# EAGLE design Chargerv1 (EAGLE 7.2.0)
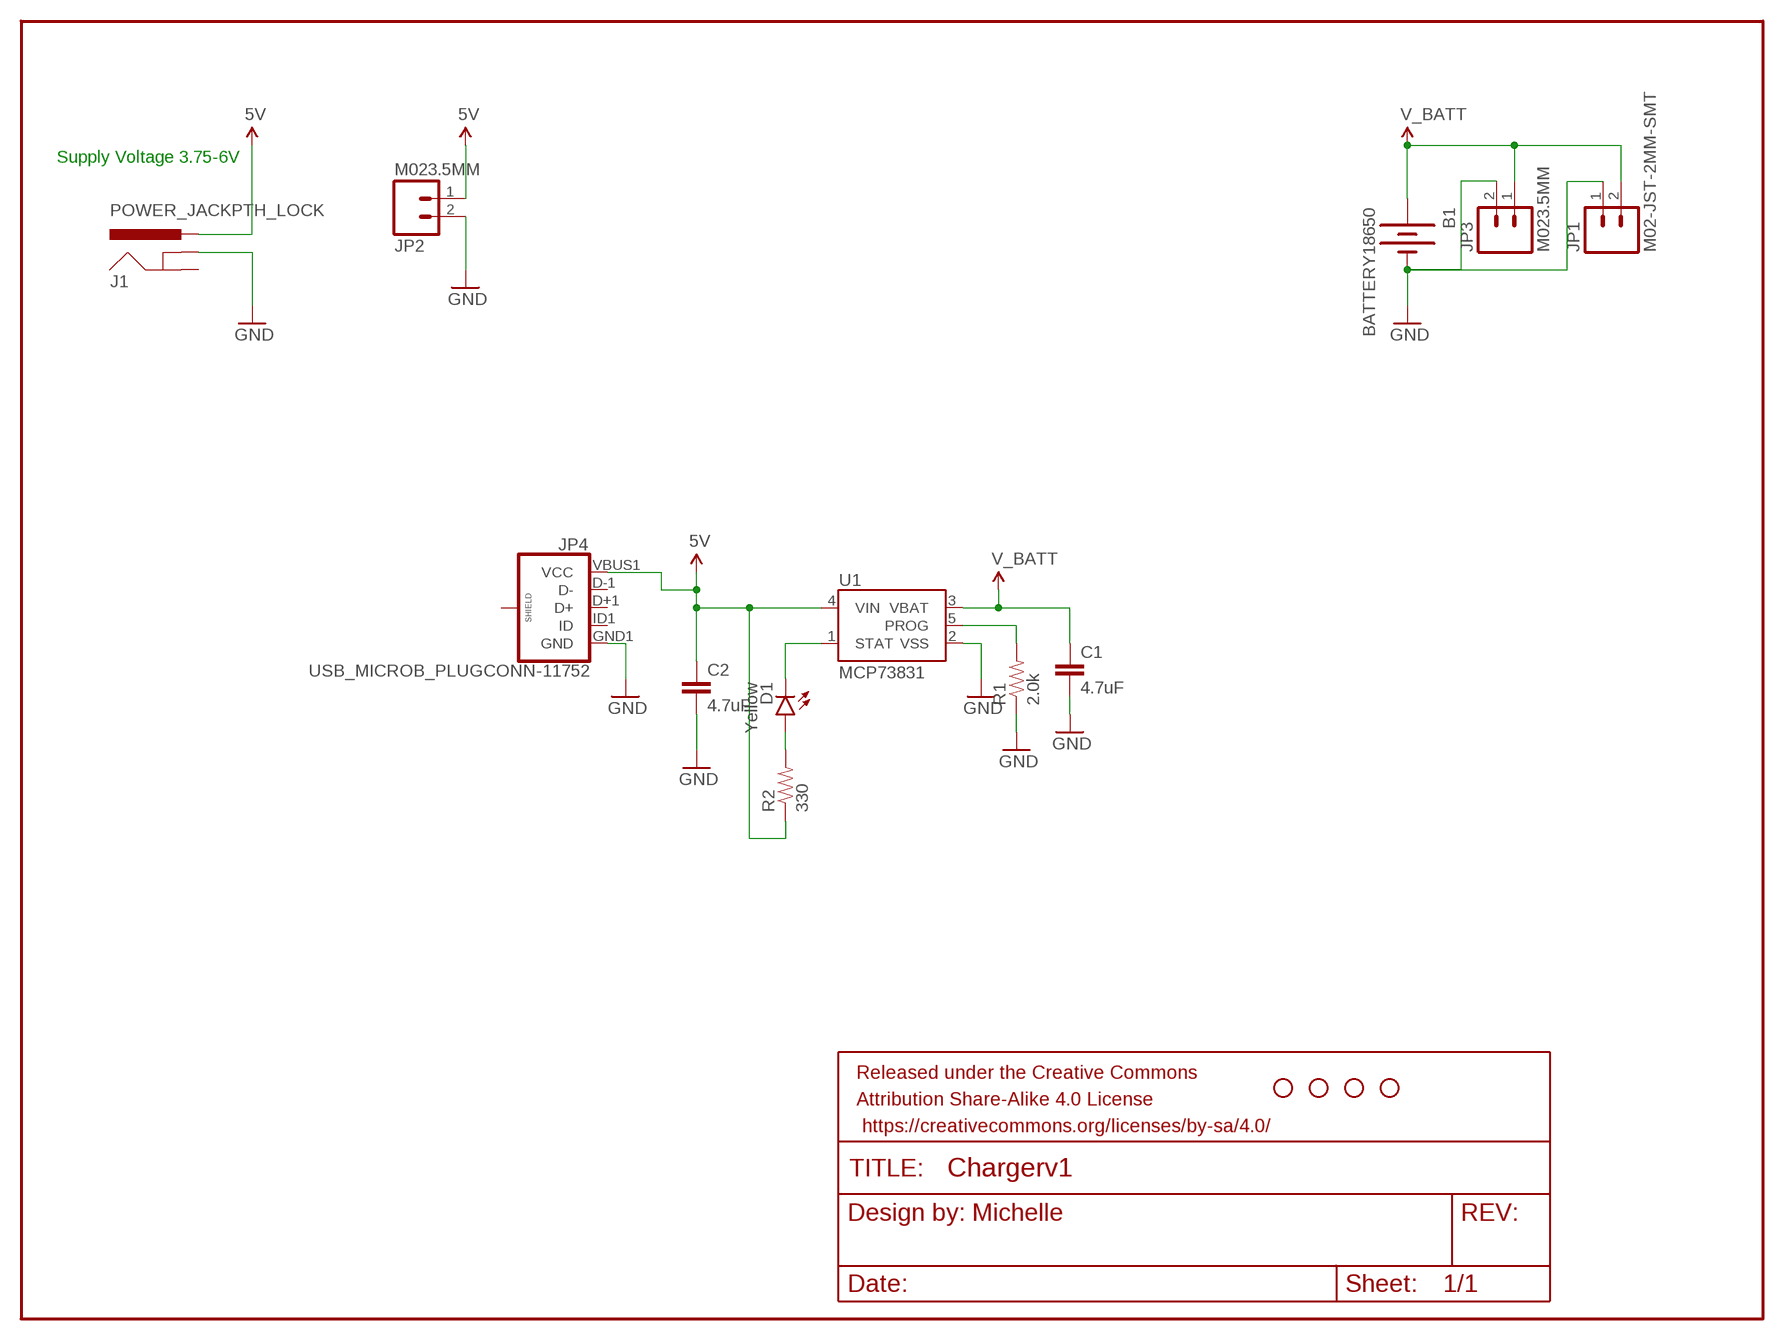
[diagram p0: schematic, sheet 1]

## Parts
B1  BATTERY18650  [18650-HOLDER]
C1  4.7uF  4.7UF-6.3V-10%(0603)0603  [0603-CAP]
C2  4.7uF  4.7UF-6.3V-10%(0603)0603  [0603-CAP]
D1  Yellow  LED-YELLOW0603  [LED-0603]
FRAME1  FRAME-LETTER  [CREATIVE_COMMONS]
J1  POWER_JACKPTH_LOCK  [POWER_JACK_PTH_LOCK]
JP1  M02-JST-2MM-SMT  [JST-2-SMD]
JP2  M023.5MM  [SCREWTERMINAL-3.5MM-2]
JP3  M023.5MM  [SCREWTERMINAL-3.5MM-2]
JP4  USB_MICROB_PLUGCONN-11752  [USB-B-MICRO-SMD_V03]
R1  2.0k  2.0KOHM1/10W5%(0603)  [0603-RES]
R2  330  330OHM1/10W1%(0603)  [0603-RES]
STANDOFF1  STAND-OFF  [STAND-OFF]
STANDOFF2  STAND-OFF  [STAND-OFF]
STANDOFF3  STAND-OFF  [STAND-OFF]
STANDOFF4  STAND-OFF  [STAND-OFF]
U1  MCP73831  [SOT23-5]

## Nets
5V: C2.1 J1.PWR JP2.1 JP4.VBUS1(VCC) R2.1 U1.4(VIN)
GND: B1.GND@1(-) C1.2 C2.2 J1.GNDBREAK JP1.1 JP2.2 JP3.2 JP4.GND1(GND) R1.1 U1.2(VSS)
N$1: D1.A R2.2
N$2: D1.C U1.1(STAT)
N$7: R1.2 U1.5(PROG)
V_BATT: B1.PWR@1(+) C1.1 JP1.2 JP3.1 U1.3(VBAT)
Unconnected: J1.GND JP4.D+1(D+) JP4.D-1(D-) JP4.ID1(ID) JP4.SHIELD1(SHIELD) JP4.SHIELD2(SHIELD) JP4.SHIELD3(SHIELD)

## Notes on the sheet
- Supply Voltage 3.75-6V

## Library data of the parts
B1 = Battery Holder 18650:BATTERY
C1 C2 = SparkFun-Capacitors:4.7UF-6.3V-10%(0603): CAP-08280; PROD_ID: CAP-08280
D1 = SparkFun-LED:LED-YELLOW: Yellow SMD LEDs LilyPad 1206- DIO-09909 0603- DIO-09003; PROD_ID: DIO-09003
FRAME1 = SparkFun-Aesthetics:FRAME-LETTER: Schematic Frame Standard 8.5x11 US Letter frame; DESIGNER: Michelle; VERSION: v01
J1 = SparkFun-Connectors:POWER_JACK: Power Jack This is the standard 5.5mm barrel jack for power. The PTH is the most common, proven, reliable, footprint. The Slot footprint only works if the mill layer is transmitted to the PCB fab house so be warned. Mating wall wart : TOL-00298 (and others); PROD_ID: CONN-08197; SF_ID: PRT-00119
JP1 = SparkFun-Connectors:M02: Standard 2-pin 0.1" header. Use with - straight break away headers ( PRT-00116) - right angle break away headers (PRT-00553) - swiss pins (PRT-00743) - machine pins (PRT-00117) - female headers (PRT-00115) Molex polarized connector foot print use with: PRT-08233 with associated crimp pins and housings. 2.54_SCREWTERM for use with PRT-10571. 3.5mm Screw Terminal footprints for PRT-08084 5mm Screw Terminal footprints for use with PRT-08432; PROD_ID: CONN-08352
JP2 JP3 = SparkFun-Connectors:M02: Standard 2-pin 0.1" header. Use with - straight break away headers ( PRT-00116) - right angle break away headers (PRT-00553) - swiss pins (PRT-00743) - machine pins (PRT-00117) - female headers (PRT-00115) Molex polarized connector foot print use with: PRT-08233 with associated crimp pins and housings. 2.54_SCREWTERM for use with PRT-10571. 3.5mm Screw Terminal footprints for PRT-08084 5mm Screw Terminal footprints for use with PRT-08432
JP4 = SparkFun-Connectors:USB_MICROB_PLUG: USB Micro-B connectors Some male, some female. Watch your step!; PROD_ID: CONN-11752
R1 = SparkFun-Resistors:2.0KOHM1/10W5%(0603): RES-08296; PROD_ID: RES-08296
R2 = SparkFun-Resistors:330OHM1/10W1%(0603): RES-00818; PROD_ID: RES-00818
STANDOFF1-STANDOFF4 = SparkFun-Electromechanical:STAND-OFF: #4 Stand Off This is the mechanical footprint for a #4 phillips button head screw. Use the keepout ring to avoid running the screw head into surrounding components. SKU : PRT-00447
U1 = SparkFun-PowerIC:MCP73831: Miniature single cell, fully integrated Li-Ion, Li-polymer charge management controller http://ww1.microchip.com/downloads/en/DeviceDoc/21984a.pdf IC-09995; PROD_ID: IC-09995

## Board
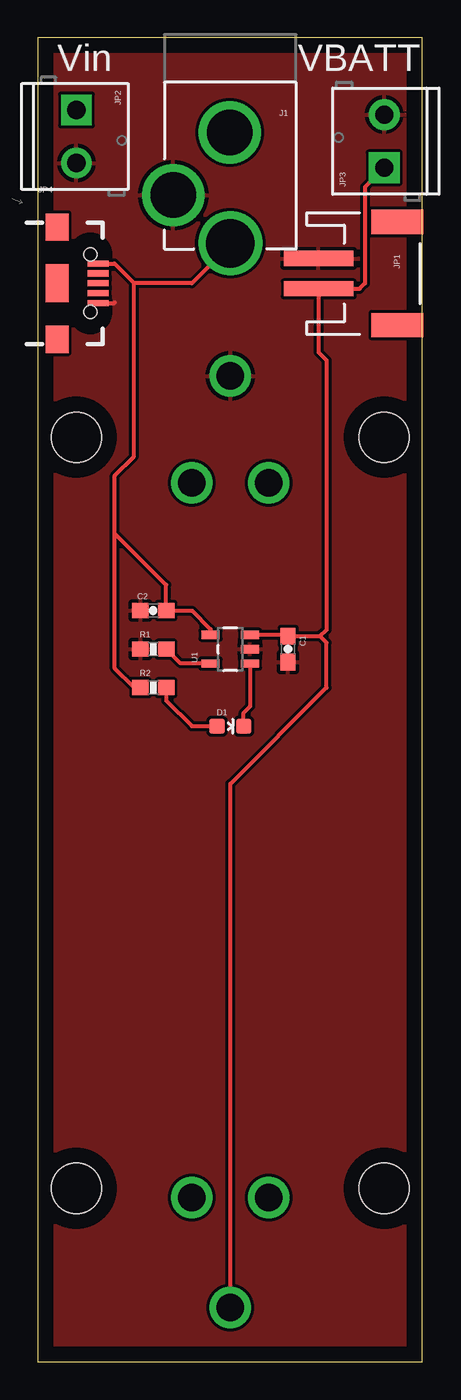
[diagram p1: board, top side]
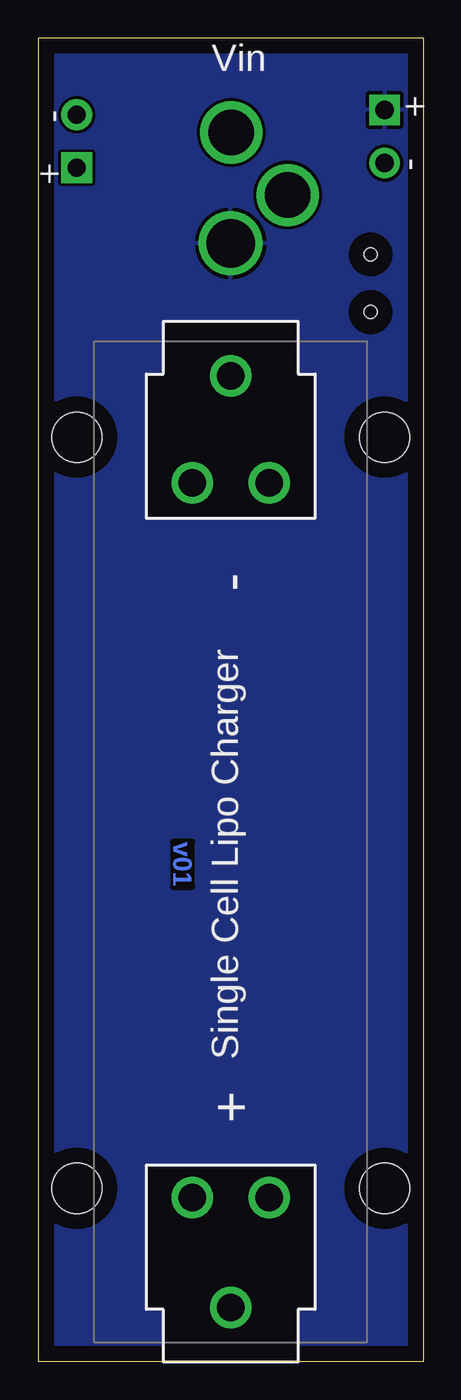
[diagram p2: board, bottom side, seen from below]

Size 25.38 x 87.3 mm. Coordinates in mm from the lower left corner, seen from the top.
Outline: 0,0 25.38,0 25.38,87.3 0,87.3 0,0
Copper layers (1*16): Top 0.035mm / dielectric 1.5mm / Bottom 0.035mm
Design rules "default": minimum track width 10mil, minimum drill 0.6mm, track to track 8mil, track to pad 8mil, pad to pad 8mil, via to via 8mil, smd to smd 8mil, copper to edge 40mil, drill to drill 8mil, minimum pad ring 10mil, minimum via ring 8mil, stop-mask expansion 4mil, vias tented up to drill 0mil, thermal gap 10mil

### Footprints (pad centres in the part's own frame; a part is rotated, then mirrored left to right if it is on the bottom)
18650-HOLDER = drill 1.829: GND@1 30.718,0; GND@2 23.67,-2.54; GND@3 23.67,2.54; PWR@1 -30.718,0; PWR@2 -23.47,-2.54; PWR@3 -23.47,2.54
0603-CAP = smd 1.1 x 1: 1 -0.85,0; 2 0.85,0
LED-0603 = smd 1 x 1: A 0,-0.877; C 0,0.877
POWER_JACK_PTH_LOCK = drill 2.997 pad 4.115: GND 0.025,6.557; GNDBREAK 3.762,10.7 | drill 3.2 pad 4.115: PWR 0,13.878
JST-2-SMD = smd 1 x 4.6: 1 -1,-3.7; 2 1,-3.7 | smd 1.6 x 3.4: NC1 -3.4,1.5; NC2 3.4,1.5
SCREWTERMINAL-3.5MM-2 = drill 1.2 pad 2.032 square: 1 0,0 | drill 1.2 pad 2.032: 2 3.5,0
USB-B-MICRO-SMD_V03 = smd 1.4 x 0.4: D+1 2.7,0; D-1 2.7,0.65; GND1 2.7,-1.3; ID1 2.7,-0.65; VBUS1 2.7,1.3 | smd 1.5 x 1.8: SHIELD1 0,3.7; SHIELD2 0,-3.7 | smd 1.5 x 2.5: SHIELD3 0,0 | hole 0.85: 2.2,1.9; 2.2,-1.9
0603-RES = smd 1.1 x 1: 1 -0.85,0; 2 0.85,0
STAND-OFF = hole 3.302: 0,0
SOT23-5 = smd 0.55 x 1.2: 1 -0.95,-1.3; 2 0,-1.3; 3 0.95,-1.3; 4 0.95,1.3; 5 -0.95,1.3

### Placement (x,y rotation side)
B1  12.7,34.29 90 bottom
C1  16.51,46.99 270 top
C2  7.62,49.53 180 top
D1  12.7,41.91 270 top
FRAME1  -8.89,-8.89 0 top  (outside the outline)
J1  12.7,87.63 180 top
JP1  22.23,71.75 270 top
JP2  2.54,82.55 270 top
JP3  22.86,78.74 90 top
JP4  1.27,71.12 0 top
R1  7.62,46.99 0 top
R2  7.62,44.45 0 top
STANDOFF1  22.86,60.96 0 top
STANDOFF2  2.54,60.96 0 top
STANDOFF3  2.54,11.43 0 top
STANDOFF4  22.86,11.43 0 top
U1  12.7,46.99 90 top

### Tracks (layer width: path | path; a pad name or v marks a point on that pad's centre or on a via)
5V
  Top 0.254: U1.4 11.4,48.29 10.16,49.53 C2.1 8.47,51.22 5.08,54.61 | R2.1 6.35,44.45 5.08,45.72 5.08,54.61 | 5.08,54.61 5.08,58.42 6.35,59.69 6.35,71.12 | 6.35,71.12 5.05,72.42 JP4.VBUS1 | J1.PWR 12.7,73.66 10.16,71.12 6.35,71.12
  pour Bottom: 0,0 25.4,0 25.4,87.63 0,87.63
GND
  Top 0.254: JP4.GND1 5.05,69.82 5.08,69.85
  pour Top: 0,0 0,87.63 25.4,87.63 25.4,86.36 25.4,0
N$1
  Top 0.254: R2.2 8.47,43.6 10.16,41.91 D1.A
N$2
  Top 0.254: U1.1 14,43.21 13.58,42.79 D1.C
N$7
  Top 0.254: U1.5 9.42,46.04 R1.2
V_BATT
  Top 0.254: U1.3 16.41,47.94 C1.1 18.63,47.84 | JP3.1 21.59,77.47 21.59,71.12 21.23,70.75 JP1.2 18.52,66.56 19.05,66.04 19.05,48.26 18.63,47.84 | B1.PWR@1 12.7,38.1 19.05,44.45 19.05,47.42 18.63,47.84

### Text on the board
tPlace: Vin | VBATT
bPlace: Vin | - | + | - | + | Single Cell Lipo Charger